# EAGLE design Adafruit CP2105 Friend (EAGLE 9.6.2)
COMPANY: ADAFRUIT INDUSTRIES; DRAWN: KTOWN; REV: A
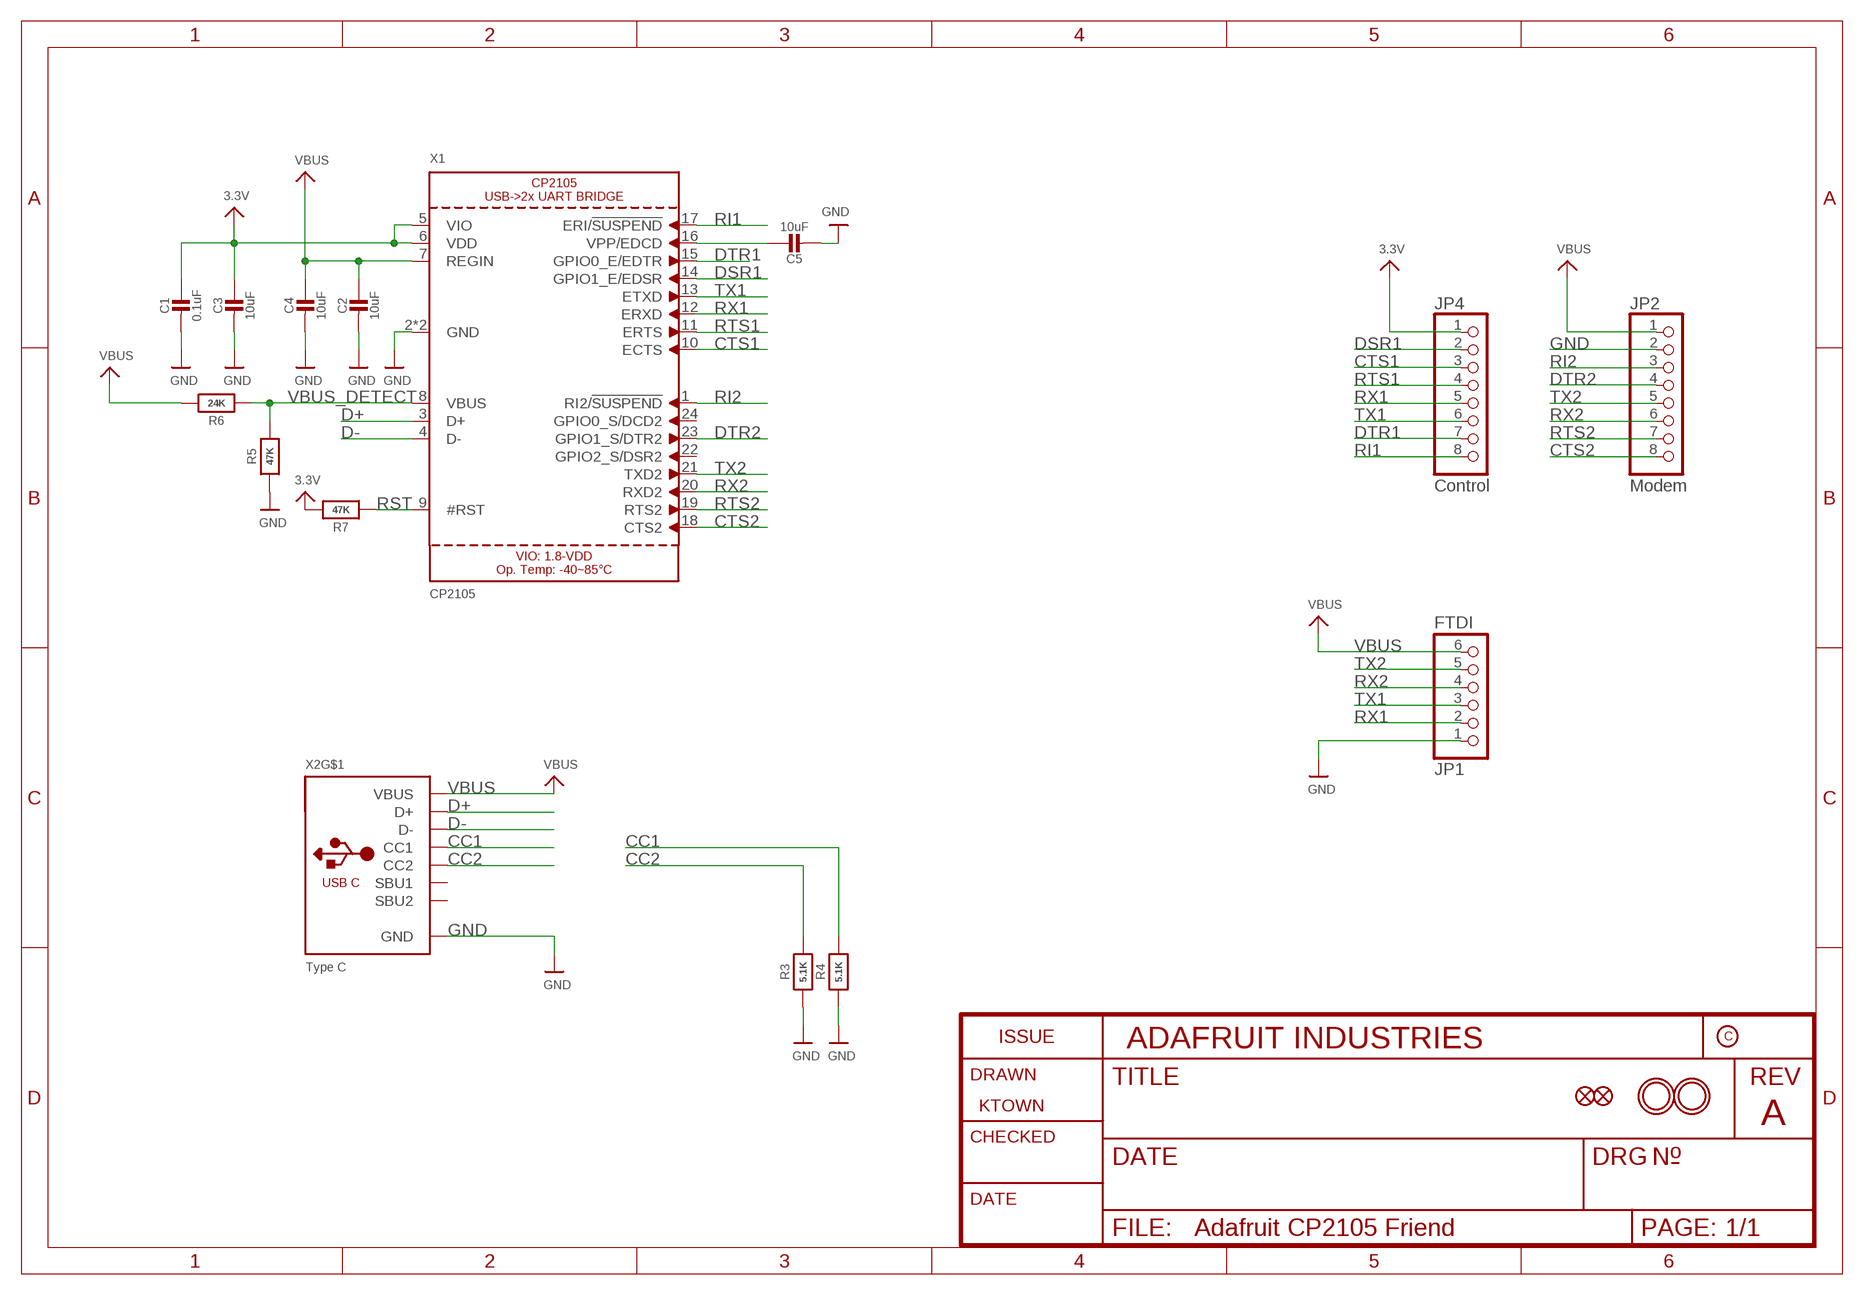
[diagram p0: schematic, sheet 1]

## Parts
C1  0.1uF  CAP_CERAMIC0603_NO  [0603-NO]
C2  10uF  CAP_CERAMIC0805-NOOUTLINE  [0805-NO]
C3  10uF  CAP_CERAMIC0805-NOOUTLINE  [0805-NO]
C4  10uF  CAP_CERAMIC0805-NOOUTLINE  [0805-NO]
C5  10uF  CAP_CERAMIC0805-NOOUTLINE  [0805-NO]
FID1  FIDUCIAL_0.5MM  [FIDUCIAL_0.5MM]
FID2  FIDUCIAL_0.5MM  [FIDUCIAL_0.5MM]
JP1  FTDI  HEADER-1X670MIL  [1X06_ROUND_70]
JP2  Modem  HEADER-1X870MIL  [1X08_ROUND_70]
JP4  Control  HEADER-1X870MIL  [1X08_ROUND_70]
R3  5.1K  RESISTOR_0603_NOOUT  [0603-NO]
R4  5.1K  RESISTOR_0603_NOOUT  [0603-NO]
R5  47K  RESISTOR_0603_NOOUT  [0603-NO]
R6  24K  RESISTOR_0603_NOOUT  [0603-NO]
R7  47K  RESISTOR_0603_NOOUT  [0603-NO]
U$18  MOUNTINGHOLE2.0  [MOUNTINGHOLE_2.0_PLATED]
U$19  MOUNTINGHOLE2.0  [MOUNTINGHOLE_2.0_PLATED]
X1  CP2105  [QFN24_4MM]
X2  Type C  USB_C  [USB_C_CUSB31-CFM2AX-01-X]

## Nets
3.3V [Power]: C1.1 C3.1 JP4.1 R7.2 X1.5(VIO) X1.6(VDD)
CC1: R4.2 X2.A5(CC1)
CC2: R3.2 X2.B5(CC2)
CTS1: JP4.3 X1.10(ECTS)
CTS2: JP2.8 X1.18(CTS2)
D+: X1.3(D+) X2.A6(D+) X2.B6(D+)
D-: X1.4(D-) X2.A7(D-) X2.B7(D-)
DSR1: JP4.2 X1.14(GPIO1_E/EDSR)
DTR1: JP4.7 X1.15(GPIO0_E/EDTR)
DTR2: JP2.4 X1.23(GPIO1_S/DTR2)
GND [Power]: C1.2 C2.2 C3.2 C4.2 C5.2 JP1.1 JP2.2 R3.1 R4.1 R5.1 X1.2(GND) X1.THERM(GND) X2.A1B12(GND) X2.B1A12(GND)
N$3: C5.1 X1.16(VPP/EDCD)
RI1: JP4.8 X1.17(ERI/!SUSPEND)
RI2: JP2.3 X1.1(RI2/!SUSPEND)
RST: R7.1 X1.9(#RST)
RTS1: JP4.4 X1.11(ERTS)
RTS2: JP2.7 X1.19(RTS2)
RX1: JP1.2 JP4.5 X1.12(ERXD)
RX2: JP1.4 JP2.6 X1.20(RXD2)
TX1: JP1.3 JP4.6 X1.13(ETXD)
TX2: JP1.5 JP2.5 X1.21(TXD2)
VBUS [Power]: C2.1 C4.1 JP1.6 JP2.1 R6.2 X1.7(REGIN) X2.A4B9(VBUS) X2.B4A9(VBUS)
VBUS_DETECT: R5.2 R6.1 X1.8(VBUS)
Unconnected: X1.22(GPIO2_S/DSR2) X1.24(GPIO0_S/DCD2) X2.A8(SBU1) X2.B8(SBU2) X2.M1(MT) X2.M2(MT) X2.M3(MT) X2.M4(MT)

## Library data of the parts
C1-C5 = microbuilder:CAP_CERAMIC: Ceramic Capacitors For new designs, use the packages preceded by an '_' character since they are more reliable: The following footprints should be used on most boards: _0402 - Standard footprint for regular board layouts _0603 - Standard footprint for regular board layouts _0805 - Standard footprint for regular board layouts _1206 - Standard footprint for regular board layouts For extremely tight-pitch boards where space is at a premium, the following 'micro-pitch' footprints can be used (smaller pads, no silkscreen outline, etc.): _0402MP - Micro-pitch footprint for very dense/compact boards _0603MP - Micro-pitch footprint for very dense/compact boards _0805MP - Micro-pitch footprint for very dense/compact boards _1206MP - Micro-pitch footprint for very dense/compact boards
FID1 FID2 = microbuilder:FIDUCIAL: Fiducial Alignment Points Various fiducial points for machine vision alignment.
JP1 = microbuilder:HEADER-1X6: PIN HEADER
JP2 JP4 = microbuilder:HEADER-1X8: PIN HEADER
R3-R7 = microbuilder:RESISTOR: Resistors For new designs, use the packages preceded by an '_' character since they are more reliable: The following footprints should be used on most boards: _0402 - Standard footprint for regular board layouts _0603 - Standard footprint for regular board layouts _0805 - Standard footprint for regular board layouts _1206 - Standard footprint for regular board layouts For extremely tight-pitch boards where space is at a premium, the following 'micro-pitch' footprints can be used (smaller pads, no silkscreen outline, etc.): _0402MP - Micro-pitch footprint for very dense/compact boards _0603MP - Micro-pitch footprint for very dense/compact boards _0805MP - Micro-pitch footprint for very dense/compact boards _1206MP - Micro-pitch footprint for very dense/compact boards
U$18 U$19 = adafruit_electromech:MOUNTINGHOLE: Mounting Hole For #2 screws (0.086"/2.18mm width, 0.094"/2.4mm hole) use 2.5mm; BOM: EXCLUDE
X1 = microbuilder:CP2105
X2 = adafruit_electromech:USB_C: USB Type-C USB 2.0 Connector; LCSC: C165948

## Net classes
1 Power: width 0.305 mm

## Board
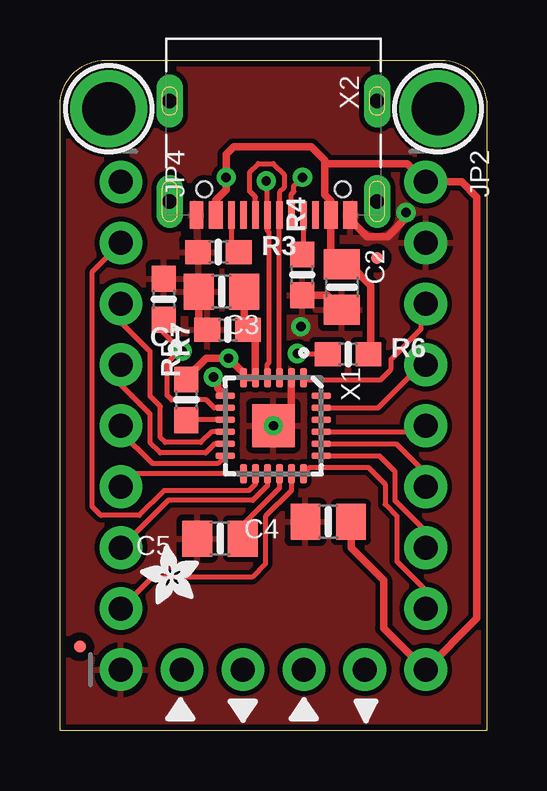
[diagram p1: board, top side]
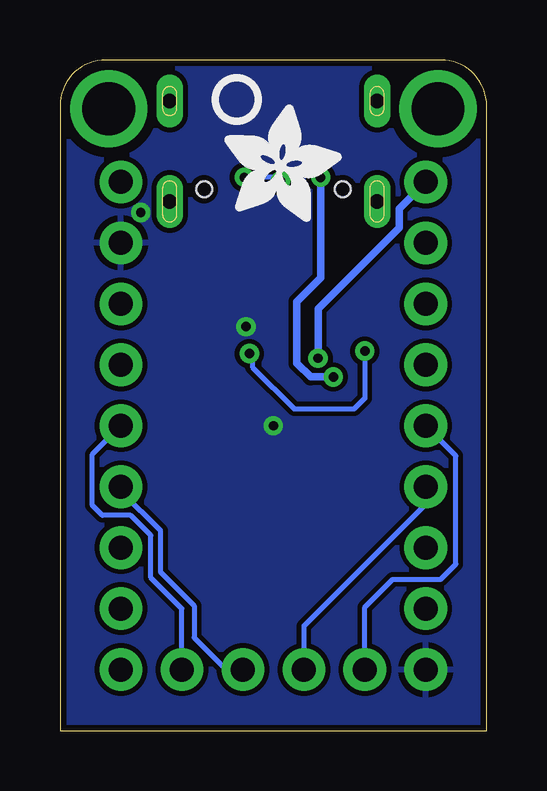
[diagram p2: board, bottom side, seen from below]

Size 17.78 x 27.94 mm. Coordinates in mm from the lower left corner, seen from the top.
Outline: 0,0 0,26.04 arc-90 1.91,27.94 15.88,27.94 arc-90 17.78,26.04 17.78,0 0,0
Copper layers (1*16): Top 0.035mm / dielectric 1.5mm / Bottom 0.035mm
Design rules "adafruit *": minimum track width 8mil, minimum drill 15.5mil, track to track 8mil, track to pad 8mil, pad to pad 8mil, via to via 8mil, smd to smd 8mil, copper to edge 10mil, drill to drill 8mil, minimum pad ring 10mil, minimum via ring 8mil, stop-mask expansion 2mil, vias tented up to drill 20mil, thermal gap 10mil

### Footprints (pad centres in the part's own frame; a part is rotated, then mirrored left to right if it is on the bottom)
0603-NO = smd 1.075 x 1: 1 -0.85,0; 2 0.85,0
0805-NO = smd 1.24 x 1.5: 1 -0.95,0; 2 0.95,0
FIDUCIAL_0.5MM = smd 0.5 x 0.5: 1 0,0
1X06_ROUND_70 = drill 1 pad 1.778: 1 -6.35,0; 2 -3.81,0; 3 -1.27,0; 4 1.27,0; 5 3.81,0; 6 6.35,0
1X08_ROUND_70 = drill 1 pad 1.778: 1 -8.89,0; 2 -6.35,0; 3 -3.81,0; 4 -1.27,0; 5 1.27,0; 6 3.81,0; 7 6.35,0; 8 8.89,0
MOUNTINGHOLE_2.0_PLATED = drill 2.2 pad 3: P$1 0,0
QFN24_4MM = smd 0.8 x 0.28: 1 -2,1.25; 2 -2,0.75; 3 -2,0.25; 4 -2,-0.25; 5 -2,-0.75; 6 -2,-1.25; 13 2,-1.25; 14 2,-0.75; 15 2,-0.25; 16 2,0.25; 17 2,0.75; 18 2,1.25 | smd 0.28 x 0.8: 7 -1.25,-2; 8 -0.75,-2; 9 -0.25,-2; 10 0.25,-2; 11 0.75,-2; 12 1.25,-2; 19 1.25,2; 20 0.75,2; 21 0.25,2; 22 -0.25,2; 23 -0.75,2; 24 -1.25,2 | smd 1.778 x 1.778: THERM 0,0
USB_C_CUSB31-CFM2AX-01-X = smd 0.575 x 1.15: A1B12 -3.2,2.275; A4B9 -2.4,2.275; B1A12 3.2,2.275; B4A9 2.4,2.275 | smd 0.275 x 1.15: A5 -1.25,2.275; A6 -0.25,2.275; A7 0.25,2.275; A8 1.25,2.275; B5 1.75,2.275; B6 0.75,2.275; B7 -0.75,2.275; B8 -1.75,2.275 | drill 0.6 pad 1 long: M1 -4.32,1.7; M2 4.32,1.7; M3 -4.32,-2.48; M4 4.32,-2.48 | hole 0.65: 2.89,1.2; -2.89,1.2

### Placement (x,y rotation side)
C1  6.99,16.7 180 top
C2  11.75,18.48 270 top
C3  6.73,18.29 180 top
C4  11.18,8.7 180 top
C5  6.67,8 180 top
FID1  0.83,3.49 0 top
FID2  13.21,19.68 0 top
JP1  8.89,2.54 0 top
JP2  15.24,13.97 270 top
JP4  2.54,13.97 270 top
PLABEL0  [PLABEL0]  16.95,23.05 90 top
PLABEL1  [PLABEL1]  16.89,19.81 90 top
PLABEL2  [PLABEL2]  16.95,15.24 90 top
PLABEL3  [PLABEL3]  13.59,17.72 90 top
PLABEL4  [PLABEL4]  13.59,12.64 90 top
PLABEL5  [PLABEL5]  16.95,10.22 90 top
PLABEL6  [PLABEL6]  13.59,7.62 90 top
PLABEL7  [PLABEL7]  16.95,5.02 90 top
PLABEL8  [PLABEL8]  0.89,23.05 90 top
PLABEL9  [PLABEL9]  0.83,20.32 90 top
PLABEL10  [PLABEL10]  0.83,17.34 90 top
PLABEL11  [PLABEL11]  4.06,15.18 90 top
PLABEL12  [PLABEL12]  0.89,12.7 90 top
PLABEL13  [PLABEL13]  4.19,10.16 90 top
PLABEL14  [PLABEL14]  0.83,7.68 90 top
PLABEL15  [PLABEL15]  0.89,4.95 90 top
PLABEL16  [PLABEL16]  2.22,0.95 0 top
PLABEL17  [PLABEL17]  15.43,0.95 0 top
PLABEL18  [PLABEL18]  12.83,4.19 0 top
PLABEL19  [PLABEL19]  10.16,4.19 0 top
PLABEL20  [PLABEL20]  7.68,4.19 0 top
PLABEL21  [PLABEL21]  4.95,4.19 0 top
PLABEL22  [PLABEL22]  9.02,6.16 0 top
PLABEL23  [PLABEL23]  8.89,19.43 0 bottom
PLABEL24  [PLABEL24]  8.89,12.7 0 bottom
PLABEL25  [PLABEL25]  8.89,5.71 0 bottom
R3  6.6,19.94 0 top
R4  10.1,18.99 90 top
R5  4.32,17.97 270 top
R6  12,15.68 0 top
R7  5.27,13.78 90 top
U$8  [ADAFRUIT_2.5MM]  5.78,5.27 90 top
U$17  [PCBFEAT-REV-040]  10.41,26.29 0 bottom
U$18  15.75,25.91 0 top
U$19  2.03,25.91 0 top
U$22  [ADAFRUIT_5MM]  10.92,21.21 0 bottom
X1  8.89,12.7 270 top
X2  8.89,23.75 180 top

### Tracks (layer width: path | path; a pad name or v marks a point on that pad's centre or on a via)
3.3V  (via drill 0.39)
  Top 0.305: C3.1 7.68,16.86 C1.1 8.14,16.7 X1.5 X1.6 7.64,14.9 v7.03,15.51 6.09,15.51 5.27,14.69 R7.2
  Bottom 0.305: JP4.1 3.65,21.75 3.65,20.95 7.03,17.57 v7.03,15.51
CC1
  Top 0.203: X2.A5 10.14,19.88 R4.2
CC2
  Top 0.203: X2.B5 7.14,20.25 R3.2
CTS1
  Top 0.203: X1.10 6.32,12.45 5.87,12.01 4.38,12.01 4.18,12.21 4.18,13.51 3.75,13.94 3.75,15.81 2.54,17.02 JP4.3
CTS2
  Top 0.203: X1.18 10.39,10.95 12.86,10.95 13.55,10.26 13.55,9.42 14.03,8.94 14.03,7.05 15.24,5.84 JP2.8
D+
  Top 0.203: X1.3 X2.A6 9.14,22.43 9.34,22.62 9.34,23.18 8.89,23.62 8.26,23.62 7.89,23.25 7.89,22.49 8.14,22.24 X2.B6
D-  (via drill 0.39)
  Top 0.203: X1.4 8.64,15.27 8.7,15.34 8.7,20.78 8.64,20.84 X2.A7 8.64,22.86 v8.6,22.9 | X2.B7 9.64,22.35 9.74,22.45 9.74,22.69 v10.1,23.05
  Bottom 0.203: v8.6,22.9 8.74,23.05 v10.1,23.05
DSR1
  Top 0.203: X1.14 8.14,10.27 7.87,9.99 4.34,9.99 3.31,8.97 1.7,8.97 1.35,9.32 1.35,19.13 JP4.2
DTR1
  Top 0.203: X1.15 8.64,10.19 8.04,9.59 4.51,9.59 JP4.7
DTR2
  Top 0.203: X1.23 13.26,13.45 15.05,15.24 JP2.4
GND  (via drill 0.39)
  Top 0.305: X1.2 9.64,13.45 X1.THERM | C1.2 5.78,17.05 C3.2 | v14.41,21.59 14.41,21.34 13.65,20.57 12.8,20.57 12.09,21.28 X2.A1B12 | C2.2 11.14,18.14 R4.1
  other vias: 8.89,12.7 10.03,16.83
  pour Top: 17.78,27.94 0,27.94 0,0 17.78,0
  pour Bottom: 17.78,27.94 0,27.94 0,0 17.78,0
N$3
  Top 0.203: X1.16 9.14,10.1 7.62,8.57 C5.1
RI1
  Top 0.203: X1.17 9.64,10 8.56,8.92 8.56,6.95 8,6.39 3.85,6.39 JP4.8
RI2
  Top 0.203: X1.1 10.23,14.61 13.34,14.61 13.79,15.06 13.79,15.48 15.05,16.74 15.05,17.59 JP2.3
RST
  Top 0.203: X1.9 5.29,12.95 R7.1
RTS1
  Top 0.203: X1.11 6.45,11.95 6.06,11.57 4.18,11.57 3.75,12 3.75,13.21 2.54,14.41 JP4.4
RTS2
  Top 0.203: X1.19 13.3,11.45 13.96,10.8 13.96,9.59 15.24,8.31 JP2.7
RX1
  Top 0.203: X1.12 6.56,11.12 3.85,11.12 2.54,12.44 JP4.5
  Bottom 0.203: JP1.2 5.08,5.14 3.92,6.3 1.92,6.3 1.28,6.93 1.28,11.44 JP4.5
RX2
  Top 0.203: X1.20 14,11.95 15.24,10.71 JP2.6
  Bottom 0.203: JP1.4 10.86,2.54 12.19,3.87 12.19,5.21 13.59,6.6 13.59,8.32 15.24,9.97 JP2.6
TX1
  Top 0.203: X1.13 3.08,10.7 JP4.6
  Bottom 0.203: JP4.6 2.54,9.44 7.62,4.36 JP1.3
TX2
  Top 0.203: X1.21 14.99,12.45 JP2.5
  Bottom 0.203: JP1.5 12.7,5.08 13.99,6.38 13.99,8.13 14.83,8.97 16.02,8.97 16.43,9.38 16.43,11.51 JP2.5
VBUS  (via drill 0.39)
  Top 0.305: X1.7 6.57,14.27 6.57,14.55 v6.39,14.73 | X2.B4A9 6.49,22.09 6.92,22.53 v6.92,23.05 6.92,24 7.24,24.32 10.48,24.32 11.04,23.76 11.04,23.62 | 11.04,23.62 11.04,22.33 11.29,22.08 X2.A4B9 11.29,19.89 C2.1 12.06,19.43 12.95,18.54 12.95,15.79 R6.2 | C4.1 12.13,7.62 13.49,6.26 13.49,4.27 15.22,2.54 JP1.6 17.37,4.67 17.37,22.23 16.74,22.86 JP2.1 14.48,23.62 11.04,23.62
  Bottom 0.305: v6.92,23.05 6.92,18.86 7.91,17.87 7.91,15.3 7.34,14.73 v6.39,14.73
VBUS_DETECT  (via drill 0.39)
  Top 0.203: X1.8 6.43,13.45 6.1,13.78 4.65,13.78 4.47,13.97 4.47,15.32 4.89,15.75 5.02,15.75 v5.08,15.81 4.32,16.57 R5.2 | v9.89,15.71 9.91,15.68 R6.1
  Bottom 0.203: v5.08,15.81 5.08,13.84 5.52,13.4 8.02,13.4 9.76,15.14 9.76,15.65 9.82,15.71 v9.89,15.71

### Text on the board
Pinguin_tBackup: 5V | 3V | 5V | RI | DSR | 3V | GND | DCD | GND | RI | DTR | CTS | RTS | RST | DTR | DSR | RX | IO3 | TX | TXD | TX | IO2 | RX | RXD | CP2102N | DTR | RTS | RTS | #SU | R | T | CP2105 | RI | SU | CTS | CTS | RX1 | 5V | T1 | R2 | RXD | TX2 | GND | GND | CTS | TXD | RTS | 5V